# Altium schematic sheet Schem_fcvv01.SchDoc
size 431 x 279 mm; SheetNumber: 1; SheetTotal: 1; ENG_APP_DATE: --/--/--; DSN_APP_DATE: --/--/--; CHK_APP_DATE: --/--/--
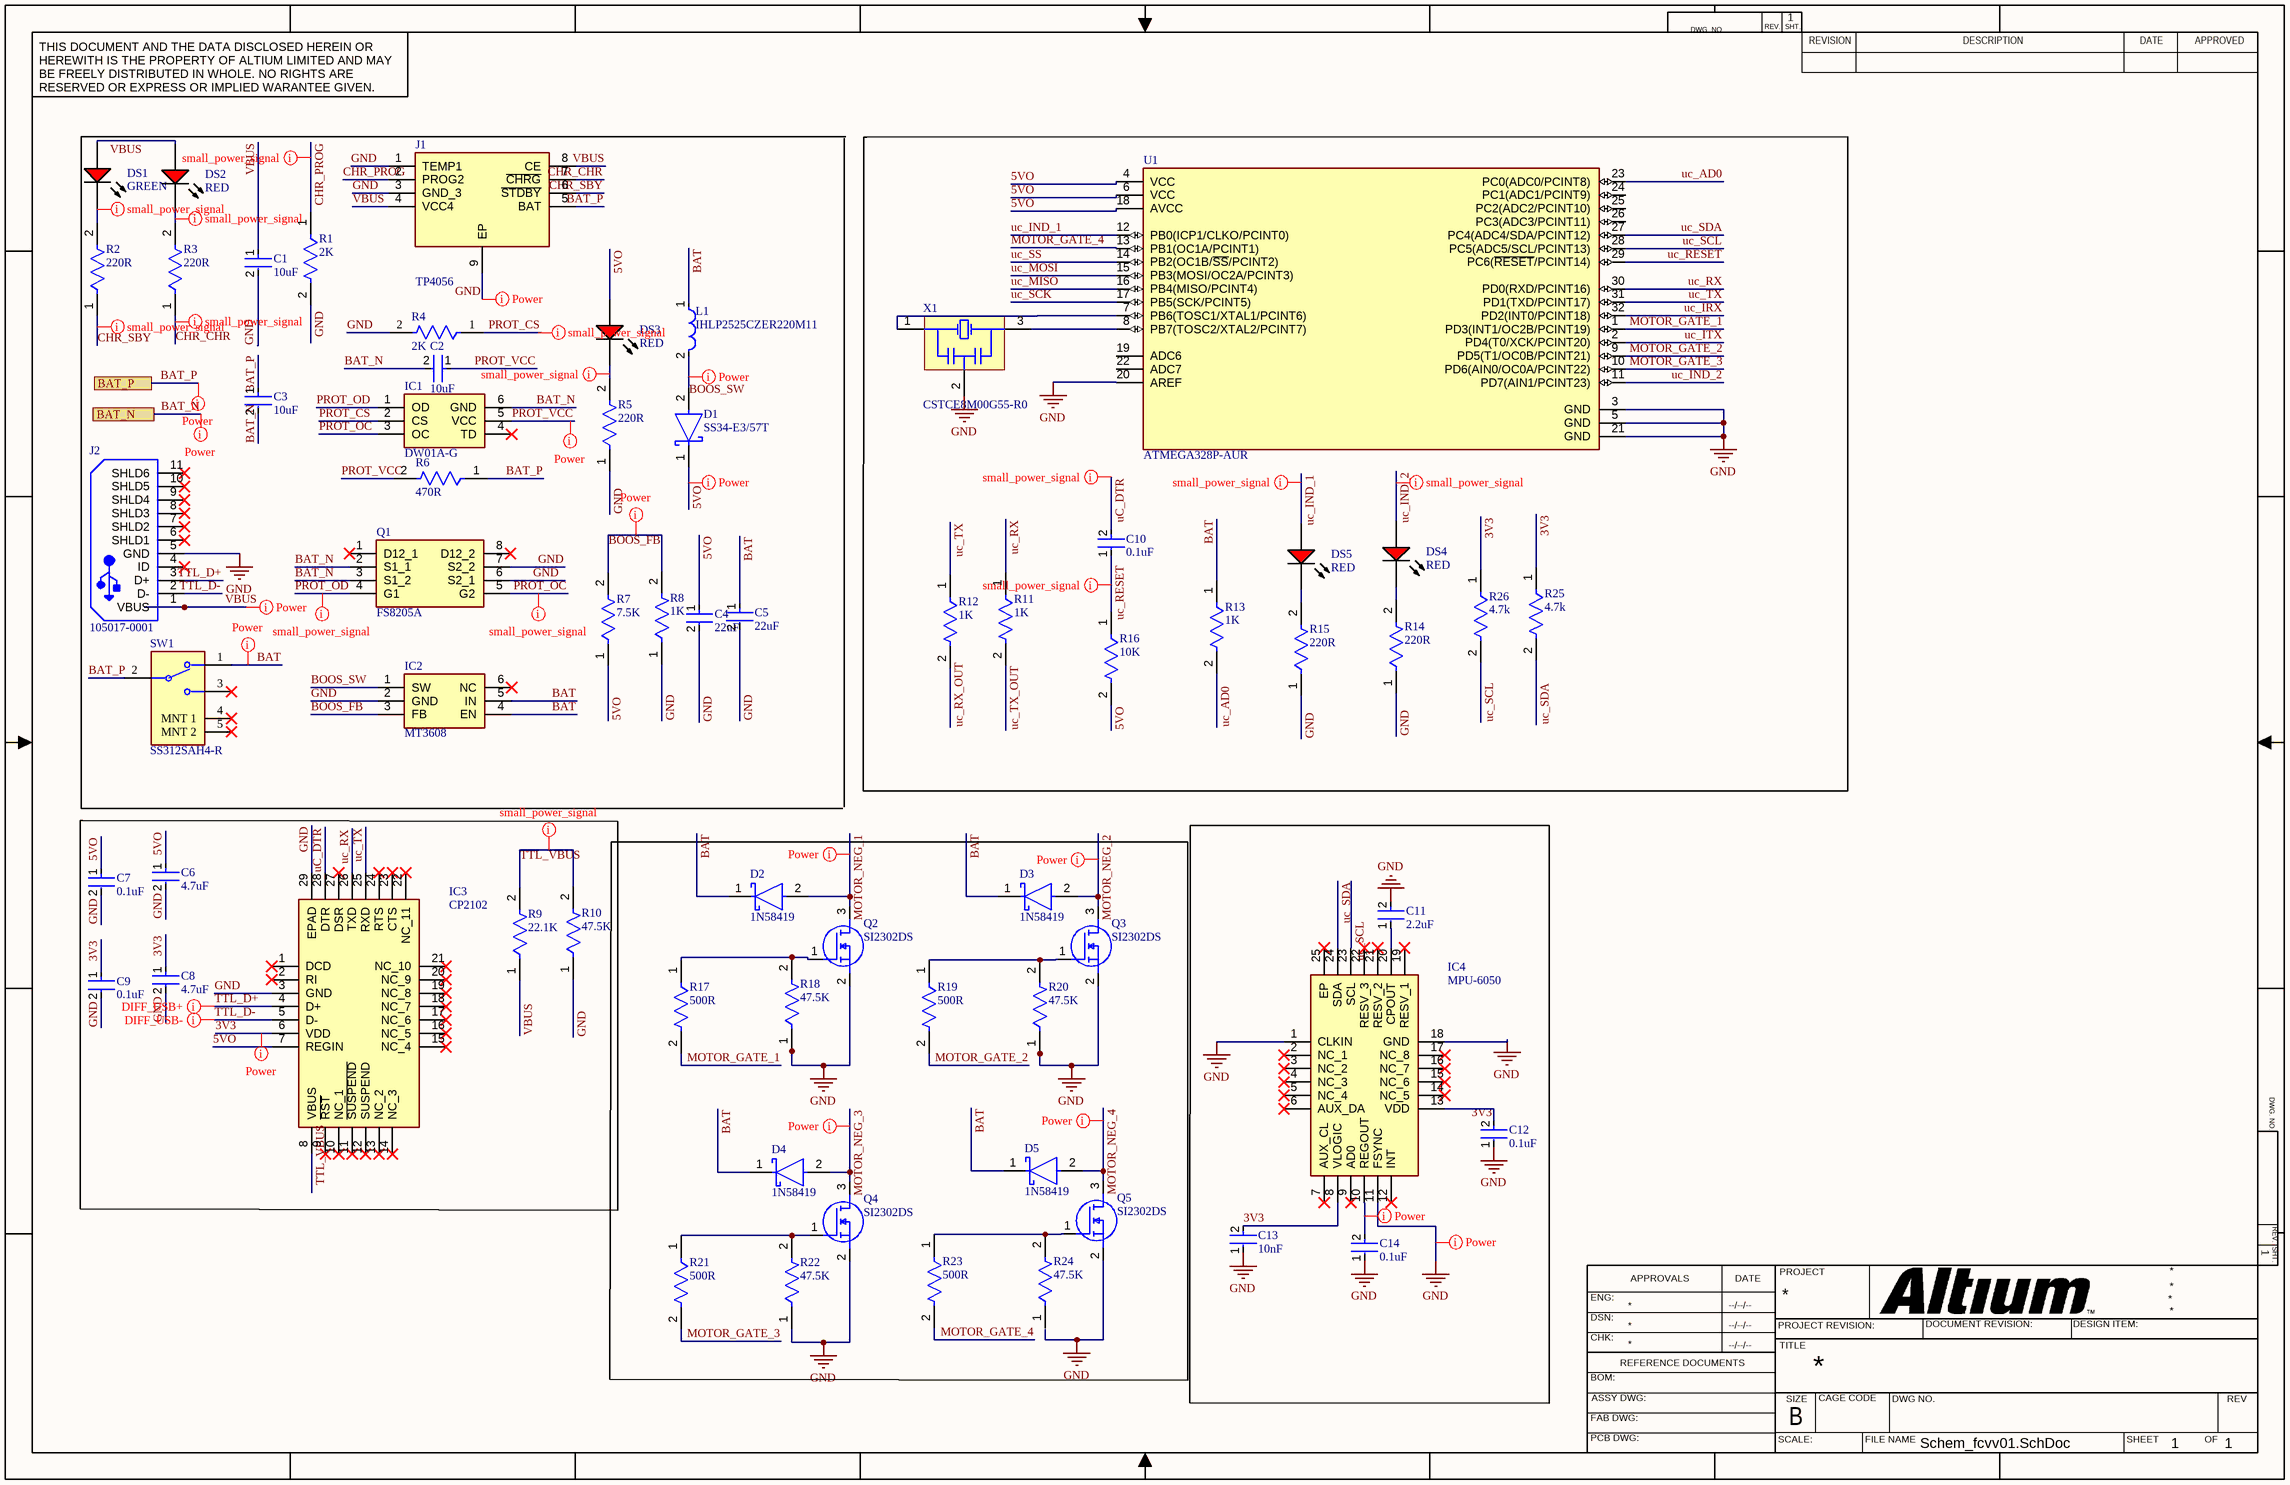
[diagram p0: Schem_fcvv01.SchDoc]

## Parts
C1  10uF  [FP-GRM188-0_1-e0_2_0_55-IPC_A]
C2  10uF  [FP-GRM188-0_1-e0_2_0_55-IPC_A]
C3  10uF  [FP-GRM188-0_1-e0_2_0_55-IPC_A]
C4  22uF  [FP-GRM188-0_1-e0_2_0_55-IPC_A]
C5  22uF  [FP-GRM188-0_1-e0_2_0_55-IPC_A]
C6  4.7uF  [FP-GRM188-0_1-e0_2_0_55-IPC_A]
C7  0.1uF  [FP-GRM188-0_1-e0_2_0_55-IPC_A]
C8  4.7uF  [FP-GRM188-0_1-e0_2_0_55-IPC_A]
C9  0.1uF  [FP-GRM188-0_1-e0_2_0_55-IPC_A]
C10  0.1uF  [FP-GRM15-MFG]
C11  2.2uF  [FP-GRM15-MFG]
C12  0.1uF  [FP-GRM15-MFG]
C13  10nF  [FP-GRM15-MFG]
C14  0.1uF  [FP-GRM15-MFG]
D1  SS34-E3/57T  [FP-95402-MFG]
D2  1N58419  [FP-425-04-IPC_C]
D3  1N58419  [FP-425-04-IPC_C]
D4  1N58419  [FP-425-04-IPC_C]
D5  1N58419  [FP-425-04-IPC_C]
DS1  GREEN  [VISH-TLMX1100_V]
DS2  RED  [VISH-TLMX1100_V]
DS3  RED  [VISH-TLMX1100_V]
DS4  RED  [VISH-TLMX1100_V]
DS5  RED  [VISH-TLMX1100_V]
IC1  DW01A-G  [SOT95P280X135-6N]
IC2  MT3608  [SOT95P280X145-6N]
IC3  CP2102  [QFN50P500X500X100-29N-D]
IC4  MPU-6050  [MPU6050]
J1  TP4056  [SOIC127P600X175-9N]
J2  105017-0001  [USB-MICRO-B_V]
L1  IHLP2525CZER220M11  [FP-IHLP-2525CZ-FP_2_413x3-MFG]
Q1  FS8205A  [SOP65P640X120-8N]
Q2  SI2302DS  [SOT95P230X110-3N]
Q3  SI2302DS  [SOT95P230X110-3N]
Q4  SI2302DS  [SOT95P230X110-3N]
Q5  SI2302DS  [SOT95P230X110-3N]
R1  2K  [FP-CRCW0402-e3-IPC_C]
R2  220R  [FP-CRCW0402-e3-IPC_C]
R3  220R  [FP-CRCW0402-e3-IPC_C]
R4  2K  [FP-ERA3A-IPC_C]
R5  220R  [FP-CRCW0402-e3-IPC_C]
R6  470R  [FP-CRCW0402-e3-IPC_C]
R7  7.5K  [FP-CRCW0402-e3-IPC_C]
R8  1K  [FP-CRCW0402-e3-IPC_C]
R9  22.1K  [FP-CRCW0402-e3-IPC_C]
R10  47.5K  [FP-CRCW0402-e3-IPC_C]
R11  1K  [FP-CRCW0402-e3-IPC_C]
R12  1K  [FP-CRCW0402-e3-IPC_C]
R13  1K  [FP-CRCW0402-e3-IPC_C]
R14  220R  [FP-CRCW0402-e3-IPC_C]
R15  220R  [FP-CRCW0402-e3-IPC_C]
R16  10K  [FP-CRCW0402-e3-IPC_C]
R17  500R  [FP-CRCW0402-e3-IPC_C]
R18  47.5K  [FP-CRCW0402-e3-IPC_C]
R19  500R  [FP-CRCW0402-e3-IPC_C]
R20  47.5K  [FP-CRCW0402-e3-IPC_C]
R21  500R  [FP-CRCW0402-e3-IPC_C]
R22  47.5K  [FP-CRCW0402-e3-IPC_C]
R23  500R  [FP-CRCW0402-e3-IPC_C]
R24  47.5K  [FP-CRCW0402-e3-IPC_C]
R25  4.7k  [FP-CRCW0402-e3-IPC_C]
R26  4.7k  [FP-CRCW0402-e3-IPC_C]
SW1  SS312SAH4-R  [FP-SS312SAH4-R-MFG]
U1  ATMEGA328P-AUR  [FP-32A-IPC_C]
X1  CSTCE8M00G55-R0  [MURA-CSTCE_G_A-3_V]

## Ports
BAT_N, BAT_P

## Nets
GND: C1.2 C4.2 C5.2 C6.2 C7.2 C8.2 C9.2 C11.2 C12.1 C13.1 C14.1 IC2.2(GND) IC3.3(GND) IC3.29(EPAD) IC4.1(CLKIN) IC4.11(FSYNC) IC4.18(GND) J1.1(TEMP1) J1.3(GND_3) J1.9(EP) J2.5(GND) Q1.6(S2_1) Q1.7(S2_2) Q2.2(S) Q3.2(S) Q4.2(S) Q5.2(S) R1.2 R4.2 R5.1 R8.1 R10.1 R14.1 R15.1 R18.1 R20.1 R22.1 U1.3(GND) U1.5(GND) U1.20(AREF) U1.21(GND) X1.2(GND)
3V3: C8.1 C9.1 C12.2 C13.2 IC3.6(VDD) IC4.8(VLOGIC) IC4.13(VDD) R25.1 R26.1
5VO: C4.1 C6.1 C7.1 D1.1(C) DS3.1(A) IC3.7(REGIN) R7.1 R16.2 U1.4(VCC) U1.6(VCC) U1.18(AVCC)
BAT: C5.1 D2.1(C) D3.1(C) D4.1(C) D5.1(C) IC2.4(EN) IC2.5(IN) L1.1 R13.1 SW1.1
BAT_N: C2.2 C3.2 IC1.6(GND) Q1.2(S1_1) Q1.3(S1_2) ; port BAT_N
BAT_P: C3.1 J1.5(BAT) R6.1 SW1.2(COM) ; port BAT_P
BOOS_FB: IC2.3(FB) R7.2 R8.2
BOOS_SW: D1.2(A) IC2.1(SW) L1.2
CHR_CHR: J1.7(~{CHRG}) R3.1
CHR_PROG: J1.2(PROG2) R1.1
CHR_SBY: J1.6(~{STDBY}) R2.1
MOTOR_GATE_1: R17.2 U1.1(PD3(INT1/OC2B/PCINT19))
MOTOR_GATE_2: R19.2 U1.9(PD5(T1/OC0B/PCINT21))
MOTOR_GATE_3: R21.2 U1.10(PD6(AIN0/OC0A/PCINT22))
MOTOR_GATE_4: R23.2 U1.13(PB1(OC1A/PCINT1))
MOTOR_NEG_1: D2.2(A) Q2.3(D)
MOTOR_NEG_2: D3.2(A) Q3.3(D)
MOTOR_NEG_3: D4.2(A) Q4.3(D)
MOTOR_NEG_4: D5.2(A) Q5.3(D)
PROT_CS: IC1.2(CS) R4.1
PROT_OC: IC1.3(OC) Q1.5(G2)
PROT_OD: IC1.1(OD) Q1.4(G1)
PROT_VCC: C2.1 IC1.5(VCC) R6.2
TTL_D+: IC3.4(D+) J2.3(D+)
TTL_D-: IC3.5(D-) J2.2(D-)
TTL_VBUS: IC3.8(VBUS) R9.2 R10.2
uc_AD0: R13.2 U1.23(PC0(ADC0/PCINT8))
uC_DTR: C10.2 IC3.28(DTR)
uc_IND_1: DS5.1(A) U1.12(PB0(ICP1/CLKO/PCINT0))
uc_IND_2: DS4.1(A) U1.11(PD7(AIN1/PCINT23))
uc_IRX: U1.32(PD2(INT0/PCINT18))
uc_ITX: U1.2(PD4(T0/XCK/PCINT20))
uc_MISO: U1.16(PB4(MISO/PCINT4))
uc_MOSI: U1.15(PB3(MOSI/OC2A/PCINT3))
uc_RESET: C10.1 R16.1 U1.29(PC6(~{RESET}/PCINT14))
uc_RX: IC3.26(TXD) R11.1 U1.30(PD0(RXD/PCINT16))
uc_RX_OUT: R12.2
uc_SCK: U1.17(PB5(SCK/PCINT5))
uc_SCL: IC4.23(SCL) R26.2 U1.28(PC5(ADC5/SCL/PCINT13))
uc_SDA: IC4.24(SDA) R25.2 U1.27(PC4(ADC4/SDA/PCINT12))
uc_SS: U1.14(PB2(OC1B/~{SS}/PCINT2))
uc_TX: IC3.25(RXD) R12.1 U1.31(PD1(TXD/PCINT17))
uc_TX_OUT: R11.2
VBUS: C1.1 DS1.1(A) DS2.1(A) J1.4(VCC4) J1.8(CE) J2.1(VBUS) R9.1
NetC11_1: C11.1 IC4.20(CPOUT)
NetC14_2: C14.2 IC4.10(REGOUT)
NetDS1_2: DS1.2(K) R2.2
NetDS2_2: DS2.2(K) R3.2
NetDS3_2: DS3.2(K) R5.2
NetDS4_2: DS4.2(K) R14.2
NetDS5_2: DS5.2(K) R15.2
NetQ2_1: Q2.1(G) R17.1 R18.2
NetQ3_1: Q3.1(G) R19.1 R20.2
NetQ4_1: Q4.1(G) R21.1 R22.2
NetQ5_1: Q5.1(G) R23.1 R24.2
NetU1_7: U1.7(PB6(TOSC1/XTAL1/PCINT6)) X1.1(X1)
NetU1_8: U1.8(PB7(TOSC2/XTAL2/PCINT7)) X1.3(X2)

Not connected (* = marked no-connect by the designer): IC1 4(TD)*; IC2 6(NC)*; IC3 1(DCD)* 2(RI)* 9(~{RST})* 10(NC_1)* 11(~{SUSPEND})* 12(SUSPEND)* 13(NC_2)* 14(NC_3)* 15(NC_4)* 16(NC_5)* 17(NC_6)* 18(NC_7)* 19(NC_8)* 20(NC_9)* 21(NC_10)* 22(NC_11)* 23(CTS)* 24(RTS)* 27(DSR)*; IC4 2(NC_1)* 3(NC_2)* 4(NC_3)* 5(NC_4)* 6(AUX_DA)* 7(AUX_CL)* 9(AD0)* 12(INT)* 14(NC_5)* 15(NC_6)* 16(NC_7)* 17(NC_8)* 19(RESV_1)* 21(RESV_2)* 22(RESV_3)* 25(EP)*; J2 4(ID)* 6(SHLD1)* 7(SHLD2)* 8(SHLD3)* 9(SHLD4)* 10(SHLD5)* 11(SHLD6)*; Q1 1(D12_1)* 8(D12_2)*; R24 1; SW1 3* 4(MNT_1)* 5(MNT_2)*; U1 19(ADC6) 22(ADC7) 24(PC1(ADC1/PCINT9)) 25(PC2(ADC2/PCINT10)) 26(PC3(ADC3/PCINT11))

## Layout directives
net class Power: 3V3, BAT_N, BAT_P, GND, MOTOR_NEG_1, MOTOR_NEG_2, MOTOR_NEG_3, MOTOR_NEG_4, NetC14_2
mark named Power: 5VO, BAT, BOOS_FB, BOOS_SW, GND, PROT_VCC, VBUS
differential pair; differential pair class USB: TTL_D+, TTL_D-
net class small_power_signal: CHR_CHR, CHR_PROG, CHR_SBY, NetDS1_2, NetDS2_2, NetDS3_2, PROT_CS, PROT_OC, PROT_OD, uC_DTR, uc_IND_1, uc_IND_2, uc_RESET
mark named small_power_signal: TTL_VBUS

## Notes on the sheet
- DWG. NO.
- REV.
- SHT.
- THIS DOCUMENT AND THE DATA DISCLOSED HEREIN OR HEREWITH IS THE PROPERTY OF ALTIUM LIMITED AND MAY BE FREELY DISTRIBUTED IN WHOLE. NO RIGHTS ARE RESERVED OR EXPRESS OR IMPLIED WARANTEE GIVEN.
- REVISION
- DESCRIPTION
- DATE
- APPROVED
- ENG:
- APPROVALS
- PROJECT
- DSN:
- CHK:
- REFERENCE DOCUMENTS
- PROJECT REVISION:
- TITLE
- DOCUMENT REVISION:
- DESIGN ITEM:
- BOM:
- FAB DWG:
- PCB DWG:
- ASSY DWG:
- SCALE:
- SIZE
- B
- CAGE CODE
- FILE NAME
- DWG NO.
- SHEET
- OF
- REV

## Library data of the parts
C1 C2 C4 C5 = CMP-2006-02792-2: 10uF 0603; Voltage Rating (DC): 6.3V; Dielectric: X5R; Material: Ceramic; Tolerance: 20%; Packaging: Tape and Reel; Width: 0.031inch; Termination: SMD/SMT; Package Quantity: 4000; Voltage Rating: 6.3V; Capacitance: 10uF; Case/Package: 0603; Min Operating Temperature: -55°C; Voltage: 6.3V; Length: 1.6mm; Thickness: 0.035inch; Lead Free: Lead Free; Depth: 0.8mm; Case Code (Imperial): 0603; Max Operating Temperature: 85°C; Height: 0.8mm; Mount: Surface Mount; REACH SVHC: No SVHC; Radiation Hardening: No; Case Code (Metric): 1608
C3 = CMP-2006-02792-2: 0603; Voltage Rating (DC): 6.3V; Dielectric: X5R; Material: Ceramic; Tolerance: 20%; Packaging: Tape and Reel; Width: 0.031inch; Termination: SMD/SMT; Package Quantity: 4000; Voltage Rating: 6.3V; Capacitance: 10uF; Case/Package: 0603; Min Operating Temperature: -55°C; Voltage: 6.3V; Length: 1.6mm; Thickness: 0.035inch; Lead Free: Lead Free; Depth: 0.8mm; Case Code (Imperial): 0603; Max Operating Temperature: 85°C; Height: 0.8mm; Mount: Surface Mount; REACH SVHC: No SVHC; Radiation Hardening: No; Case Code (Metric): 1608
C6-C9 = CMP-2006-02792-2: 0603; Voltage Rating (DC): 6.3V; Dielectric: X5R; Capacitance: 10uF; Material: Ceramic; Tolerance: 20%; Packaging: Tape and Reel; Width: 0.031inch; Termination: SMD/SMT; Package Quantity: 4000; Voltage Rating: 6.3V; Case/Package: 0603; Min Operating Temperature: -55°C; Voltage: 6.3V; Length: 1.6mm; Thickness: 0.035inch; Lead Free: Lead Free; Depth: 0.8mm; Case Code (Imperial): 0603; Max Operating Temperature: 85°C; Height: 0.8mm; Mount: Surface Mount; REACH SVHC: No SVHC; Radiation Hardening: No; Case Code (Metric): 1608
C10-C14 = CMP-2100-03641-2: CAP CER 0.1UF 16V X7R 0402; Manufacturer Part Number: GRM155R71C104KA88D; Manufacturer: Murata; Standoff Height: 0mm; Tolerance: 10%; Voltage Rating: 16Vdc; Material: Ceramic; Capacitance: 0.10μF; Value: 0.10μF; RoHS: TRUE; Temperature Characteristic: X7R; Octopart: https://octopart.com/grm155r71c104ka88d-murata-196880; Digikey Description: CAP CER 0.1UF 16V X7R 0402; Device Class L3: Ceramic Capacitors; Height: 0.55mm; ComponentLink2Description: Datasheet; Temperature Range Low: -55°C; Ipc Land Pattern Name: CAPC10050X219; ComponentLink2URL: https://search.murata.co.jp/Ceramy/image/img/A01X/G101/ENG/GRM155R71H471KA01-01A.pdf; Device Class L1: Passive Components; Lead Free: yes; Category: Cap; Package: GRM15; Temperature: -55°C to +125°C; Device Class L2: Capacitors; Temperature Range High: +125°C; Mouser Description: 0402 0.1 uF 16V ±10 % Tolerance X7R SMT Multilayer Ceramic Capacitor
D1 = CMP-02539-000012-1: DIODE SCHOTTKY 40V 3A DO214AB; Manufacturer: Vishay; Max Junction Temp: +150°C; Peak Reverse Current: 0.5mA; Max Surge Forward Current: 100A; Standoff Height: 0mm; ComponentLink2Description: Datasheet; Device Class L3: Schottky Diodes; Height: 2.62mm; Max Repetitive Reverse Voltage: 40V; Lead Free: Yes; Package: 95402; Temperature Range High: +150°C; ComponentLink2URL: http://www.vishay.com/docs/88751/ss32.pdf; Temperature: -55°C to +150°C; Footprint Url: http://www.vishay.com/docs/95402/smc.pdf; Automotive: No; Forward Current: 3A; Category: Diode; Manufacturer Part Number: SS34-E3/57T; RoHS: TRUE; Device Class L2: Diodes; Mouser Description: Schottky Diodes & Rectifiers 3.0 Amp 40 Volt; Octopart: https://octopart.com/ss34-e3%2F57t-vishay-39552907; Temperature Range Low: -55°C; Device Class L1: Discrete Semiconductors; Digikey Description: DIODE SCHOTTKY 40V 3A DO214AB
D2-D5 = CMP-1055-00425-2: DIODE SCHOTTKY 20V 500MA SOD123; Polarity: Standard; Peak Non-Repetitive Surge Current: 5.5A; Forward Voltage: 385mV; Element Configuration: Single; Peak Reverse Current: 250uA; Max Repetitive Reverse Voltage (Vrrm): 20V; Voltage Rating (DC): 20V; Case/Package: SOD-123-2; Number of Pins: 2; Output Current: 500mA; Min Operating Temperature: -65°C; Lead Free: Lead Free; REACH SVHC: No SVHC; Max Reverse Voltage (DC): 20V; Termination: SMD/SMT; Average Rectified Current: 500mA; Max Surge Current: 5.5A; Package Quantity: 3000; Height: 1.12mm; Current Rating: 500mA; Forward Current: 500mA; Max Forward Surge Current (Ifsm): 5.5A; Packaging: Tape and Reel; Length: 2.69mm; Radiation Hardening: No; Max Reverse Leakage Current: 250uA; Width: 1.6mm; Contact Plating: Tin; Max Operating Temperature: 125°C
DS1-DS5 = CMP-1666-00027-1: Red 0603 Light Emitting Diodes (LED) ROHS/NCD0603R1; Type (Capacitors): C0G; Resistance: 100000000000 Ohm; Capacitance: 12 pF; Voltage Rating: 50 V; Tolerance: 5%; Min Operating Temperature: -55degC; REACH SVHC: No SVHC; ComponentLink2Description: Datasheet; ComponentLink1URL: http://www.vishay.com/; Width: 0.8 mm; Package Quantity: 4000; PackageReference: TLMX1100; ComponentLink2URL: http://www.vishay.com/docs/83173/tlmb1100.pdf; Case/Package: 0603; Case Code (Metric): 1608; Packaging: Tape and Reel; Pins: 2; ComponentLink1Description: Manufacturer URL; Max Operating Temperature: 125degC; Height: 0.8 mm; Length: 1.6 mm; Mount: Surface Mount; PackageDescription: 2-Pin Surface Mount Device, Body 1.6 x 0.8 mm; DatasheetVersion: Rev. 2.7, 03/2016; Case Code (Imperial): 0603; Voltage Rating (DC): 50 V; RoHSCompliant: True; Radiation Hardening: No
IC1 = DW01A-G: Integrated Circuit; Manufacturer_Name: Fortune Semiconductor Corporation; Datasheet Link: http://acoptex.com/uploads/DW01A.pdf; Height: 1.35mm; Manufacturer_Part_Number: DW01A-G
IC2 = MT3608: Integrated Circuit; Manufacturer_Name: Aerosemi; Datasheet Link: https://www.olimex.com/Products/Breadboarding/BB-PWR-3608/resources/MT3608.pdf; Height: 1.45mm; Manufacturer_Part_Number: MT3608
IC3 = CP2102: Integrated Circuit; Manufacturer_Name: Silicon Labs; Datasheet Link: https://componentsearchengine.com/Datasheets/1/CP2102.pdf; Height: 1mm; Manufacturer_Part_Number: CP2102; Mouser Part Number: 634-CP2102; Mouser Price/Stock: https://www.mouser.co.uk/ProductDetail/Silicon-Labs/CP2102?qs=ucY0lxHzU7615lOm95XT0w%3D%3D
IC4 = MPU-6050: Integrated Circuit; Manufacturer_Name: TDK; Datasheet Link: https://product.tdk.com/system/files/dam/doc/product/sensor/mortion-inertial/imu/data_sheet/mpu-6000-datasheet1.pdf; Height: 0.95mm; Manufacturer_Part_Number: MPU-6050; Mouser Part Number: 410-MPU-6050; Mouser Price/Stock: https://www.mouser.co.uk/ProductDetail/TDK-InvenSense/MPU-6050?qs=u4fy%2FsgLU9O14B5JgyQFvg%3D%3D; Arrow Part Number: MPU-6050; Arrow Price/Stock: https://www.arrow.com/en/products/mpu-6050/invensense?region=nac
J1 = TP4056: Connector; Manufacturer_Name: NanJing Top Power; Datasheet Link: https://dlnmh9ip6v2uc.cloudfront.net/datasheets/Prototyping/TP4056.pdf; Height: 1.75mm; Manufacturer_Part_Number: TP4056
J2 = CMP-2000-05827-1: Micro-USB B Receptacle, Right Angle, Bottom Mount, Surface Mount, with Solder Tabs, -30 to 85 degC, 5-Pin USB, RoHS, Tape and Reel; Manufacturer: Molex; Featured Product: Micro-USBConnectorsUSBConnectors; Other Names: WM1399DKR; Package Version: Rev. F, 12/2012; Number of Contacts: 5; Connector Type: USB-microB; Catalog Drawings: 1050170001; 3D Model: 105017-0001.stp; Mating Products: WM17145-ND-CABLEMICROUSBBTOSTDA1.0MWM17147-ND-CABLEMICROUSBBTOSTDA2.0MWM17146-ND-CABLEMICROUSBBTOSTDA1.5M; PCN Assembly/Origin: ResinSupplier21/Oct/2015; Voltage - Max: 30V; Online Catalog: Molex-MicroUSB; Manufacturer URL: http://www.molex.com/; Package Description: 5-Leads USB, Micro B, Body 7.5 x 5 mm, Pitch 0.65 mm; Datasheet URL: http://www.molex.com/elqNow/elqRedir.htm?ref=http://www.molex.com/webdocs/datasheets/pdf/en-us/1050170001_IO_CONNECTORS.pdf; Ingress Protection: -; Datasheet Version: 03/2016; Mounting Type: BoardCutout,SurfaceMount,RightAngle; Circuits: 5; Standard Package: 1; Package Reference: MICRO-B; Package URL: http://www.molex.com/pdm_docs/sd/1050170001_sd.pdf; Category: Connectors,Interconnects; Series: -; RoHS Information: 1050170001CertofCompliance; Features: Shielded,SolderRetention; Family: USB,DVI,HDMIConnectors; Specifications: -; Gender: Receptacle; Packaging: Digi-Reel®; Mounting Technology: SurfaceMount
L1 = CMP-2000-06442-2: Commercial Inductors, Low DCR Series 22uH 2.9A 135mΩ 20%; Self Resonant Frequency: 1MHz; Shielding: Shielded; Core Material: Ferrite; DC Resistance (DCR): 135mR; Test Frequency: 100kHz; Saturation Current: 2.5A; Case/Package: 2525; Inductance Tolerance: 20%; Max DC Current: 2.9A; Inductance: 22uH; Termination: SMD/SMT; Case Code (Imperial): 2525; Mount: Surface Mount; Military Standard: Not; Min Operating Temperature: -55°C; RMS Current (Irms): 2.9A; Package Quantity: 2000; Max Operating Temperature: 125°C; Length: 7.24mm; Depth: 6.72mm; Packaging: Tape and Reel; Height: 3mm; Width: 0.255inch; Lead Free: Lead Free; Tolerance: 20%; Contact Plating: Tin; Current Rating: 2.9A; Number of Pins: 2; Case Code (Metric): 6363; Radiation Hardening: No; Height - Seated (Max): 0.118inch
Q1 = FS8205A: Transistor; Manufacturer_Name: SII Semiconductor; Datasheet Link: http://www.ic-fortune.com/upload/Download/FS8205A-DS-12_EN.pdf; Height: 1.2mm; Manufacturer_Part_Number: FS8205A
Q2-Q5 = SI2302DS: MOSFET (N-Channel); Manufacturer_Name: Nexperia; Datasheet Link: https://assets.nexperia.com/documents/data-sheet/SI2302DS.pdf; Height: 1.1mm; Manufacturer_Part_Number: SI2302DS; Mouser Part Number: N/A; Mouser Price/Stock: https://www.mouser.com/Search/Refine.aspx?Keyword=N%2FA
R1 = CMP-2002-08122-2: 62.5mW Thick Film Resistors 50V ±100ppm/℃ ±5% -55℃~+155℃ 2kΩ 0402 Chip Resistor - Surface Mount ROHS/CR-02JL6----2K; Max Power Dissipation: 63mW; Temperature Coefficient: 100ppm/°C; Resistance: 0mR; Tolerance: 5%; Contact Plating: Tin; Height: 0.35mm; Radiation Hardening: No; Features: Automotive AEC-Q200; Composition: Thick Film; Width: 0.5mm; Weight: 2.3E-05oz; Termination: SMD/SMT; Packaging: Tape and Reel; Mount: Surface Mount; Case Code (Metric): 1005; Military Standard: Not; Min Operating Temperature: -55°C; Number of Terminations: 2; Package Quantity: 1; Voltage Rating: 50V; Case Code (Imperial): 0402; Depth: 0.5mm; Max Operating Temperature: 155°C; Case/Package: 0402; Power Rating: 63mW; Lead Free: Lead Free; Voltage Rating (DC): 50V; Length: 1mm
R2 R3 R5 R14 R15 = CMP-2002-08122-2: 62.5mW Thick Film Resistors 50V ±100ppm/℃ ±1% -55℃~+155℃ 220Ω 0402 Chip Resistor - Surface Mount ROHS/RC0402FR-07220RL; Tolerance: 5%; Max Power Dissipation: 63mW; Temperature Coefficient: 100ppm/°C; Resistance: 0mR; Contact Plating: Tin; Height: 0.35mm; Radiation Hardening: No; Features: Automotive AEC-Q200; Composition: Thick Film; Width: 0.5mm; Weight: 2.3E-05oz; Termination: SMD/SMT; Packaging: Tape and Reel; Mount: Surface Mount; Case Code (Metric): 1005; Military Standard: Not; Min Operating Temperature: -55°C; Number of Terminations: 2; Package Quantity: 1; Voltage Rating: 50V; Case Code (Imperial): 0402; Depth: 0.5mm; Max Operating Temperature: 155°C; Case/Package: 0402; Power Rating: 63mW; Lead Free: Lead Free; Voltage Rating (DC): 50V; Length: 1mm
R4 = CMP-2000-00874-2: 100mW Thick Film Resistors 75V ±1% -55℃~+155℃ 2kΩ 0603 Chip Resistor - Surface Mount ROHS/CR-03FA7----2K; Resistance: 10kR; Temperature Coefficient: 25ppm/°C; Resistance Tolerance: 0.1%; Radiation Hardening: No; Width: 0.8mm; Depth: 0.8mm; Construction: Rectangular; Case Code (Metric): 1608; Package Quantity: 5000; Voltage Rating (DC): 75V; Length: 1.6mm; Size Code: 0603; Case Code (Imperial): 0603; Termination: SMD/SMT; Power Rating: 100mW; Contact Plating: Tin; Military Standard: Not; Packaging: Tape and Reel; Max Power Dissipation: 100mW; REACH SVHC: No SVHC; Series: ERA-3A; Voltage Rating: 75V; Lead Free: Lead Free; Technology: METAL FILM; RoHS Compliant: Yes; Max Operating Temperature: 155°C; Resistor Type: Thin Film; Min Operating Temperature: -55°C; Number of Pins: 2; Case/Package: 0603; Tolerance: 0.1%; Height: 0.45mm; Mount: Surface Mount; Number of Terminations: 2
R6 = CMP-2002-08122-2: 62.5mW Thick Film Resistors 50V ±100ppm/℃ ±1% -55℃~+155℃ 470Ω 0402 Chip Resistor - Surface Mount ROHS/AC0402FR-07470RL; Tolerance: 5%; Max Power Dissipation: 63mW; Temperature Coefficient: 100ppm/°C; Resistance: 0mR; Contact Plating: Tin; Height: 0.35mm; Radiation Hardening: No; Features: Automotive AEC-Q200; Composition: Thick Film; Width: 0.5mm; Weight: 2.3E-05oz; Termination: SMD/SMT; Packaging: Tape and Reel; Mount: Surface Mount; Case Code (Metric): 1005; Military Standard: Not; Min Operating Temperature: -55°C; Number of Terminations: 2; Package Quantity: 1; Voltage Rating: 50V; Case Code (Imperial): 0402; Depth: 0.5mm; Max Operating Temperature: 155°C; Case/Package: 0402; Power Rating: 63mW; Lead Free: Lead Free; Voltage Rating (DC): 50V; Length: 1mm
R7 = CMP-2002-08122-2: 63mW Thick Film Resistors 50V ±100ppm/℃ ±1% -55℃~+125℃ 7.5kΩ 0402 Chip Resistor - Surface Mount ROHS/AECR0402F7K50K9; Tolerance: 5%; Temperature Coefficient: 100ppm/°C; Resistance: 0mR; Contact Plating: Tin; Height: 0.35mm; Radiation Hardening: No; Max Power Dissipation: 63mW; Features: Automotive AEC-Q200; Composition: Thick Film; Width: 0.5mm; Weight: 2.3E-05oz; Termination: SMD/SMT; Packaging: Tape and Reel; Mount: Surface Mount; Case Code (Metric): 1005; Military Standard: Not; Min Operating Temperature: -55°C; Number of Terminations: 2; Package Quantity: 1; Voltage Rating: 50V; Case Code (Imperial): 0402; Depth: 0.5mm; Max Operating Temperature: 155°C; Case/Package: 0402; Power Rating: 63mW; Lead Free: Lead Free; Voltage Rating (DC): 50V; Length: 1mm
R8 R11-R13 R16 R25 R26 = CMP-2002-08122-2: 62.5mW Thick Film Resistors 50V ±100ppm/℃ ±1% -55℃~+155℃ 1kΩ 0402 Chip Resistor - Surface Mount ROHS/RC0402FR-071KL; Tolerance: 5%; Max Power Dissipation: 63mW; Temperature Coefficient: 100ppm/°C; Resistance: 0mR; Contact Plating: Tin; Height: 0.35mm; Radiation Hardening: No; Features: Automotive AEC-Q200; Composition: Thick Film; Width: 0.5mm; Weight: 2.3E-05oz; Termination: SMD/SMT; Packaging: Tape and Reel; Mount: Surface Mount; Case Code (Metric): 1005; Military Standard: Not; Min Operating Temperature: -55°C; Number of Terminations: 2; Package Quantity: 1; Voltage Rating: 50V; Case Code (Imperial): 0402; Depth: 0.5mm; Max Operating Temperature: 155°C; Case/Package: 0402; Power Rating: 63mW; Lead Free: Lead Free; Voltage Rating (DC): 50V; Length: 1mm
R9 R17 R19 R21 R23 = CMP-2002-08122-2: 62.5mW Thick Film Resistors 50V ±100ppm/℃ ±1% -55℃~+155℃ 22.1kΩ 0402 Chip Resistor - Surface Mount ROHS/RC0402FR-0722K1L; Tolerance: 5%; Max Power Dissipation: 63mW; Temperature Coefficient: 100ppm/°C; Resistance: 0mR; Contact Plating: Tin; Height: 0.35mm; Radiation Hardening: No; Features: Automotive AEC-Q200; Composition: Thick Film; Width: 0.5mm; Weight: 2.3E-05oz; Termination: SMD/SMT; Packaging: Tape and Reel; Mount: Surface Mount; Case Code (Metric): 1005; Military Standard: Not; Min Operating Temperature: -55°C; Number of Terminations: 2; Package Quantity: 1; Voltage Rating: 50V; Case Code (Imperial): 0402; Depth: 0.5mm; Max Operating Temperature: 155°C; Case/Package: 0402; Power Rating: 63mW; Lead Free: Lead Free; Voltage Rating (DC): 50V; Length: 1mm
R10 R18 R20 R22 R24 = CMP-2002-08122-2: 62.5mW Thin Film Resistor 25V ±0.5% ±50ppm/℃ -55℃~+155℃ 47.5kΩ 0402 Chip Resistor - Surface Mount ROHS/AR02DTD4752; Tolerance: 5%; Max Power Dissipation: 63mW; Voltage Rating: 50V; Temperature Coefficient: 100ppm/°C; Resistance: 0mR; Contact Plating: Tin; Height: 0.35mm; Radiation Hardening: No; Features: Automotive AEC-Q200; Composition: Thick Film; Width: 0.5mm; Weight: 2.3E-05oz; Termination: SMD/SMT; Packaging: Tape and Reel; Mount: Surface Mount; Case Code (Metric): 1005; Military Standard: Not; Min Operating Temperature: -55°C; Number of Terminations: 2; Package Quantity: 1; Case Code (Imperial): 0402; Depth: 0.5mm; Max Operating Temperature: 155°C; Case/Package: 0402; Power Rating: 63mW; Lead Free: Lead Free; Voltage Rating (DC): 50V; Length: 1mm
SW1 = CMP-31746-000001-1: SWITCH SLIDE SPDT 0.4VA 28V; Mechanical Life: 10000Cycles; Switch Function: On-On; Actuator Length: 2mm; Contact Style: Shorting; Max Current Rating: 100mA; Actuator Type: Standard; Actuator Material: Polyphenylene; Length: 10.5mm; Orientation: Right Angle; Voltage Rating (DC): 28V; Contact Material: Bronze; Electrical Life: 10000Cycles; Max Operating Temperature: 85°C; Case/Package: SMD/SMT; Depth: 7.45mm; Contact Plating: Gold; Voltage Rating (AC): 28V; Package Quantity: 1; Min Operating Temperature: -25°C; Switch Travel: 2mm; Housing Material: Bronze; RoHS Compliant: Yes; Lead Free: Lead Free; Termination: Gull Wing; Packaging: Tape and Reel; REACH SVHC: No SVHC; Mount: Surface Mount; Series: SS3; Throw Configuration: SPDT; Max Voltage Rating (AC): 28V; Max Voltage Rating (DC): 28V
U1 = CMP-06276-000046-1: IC MCU 8BIT 32KB FLASH 32TQFP; Number of I/Os: 32; Oscillator Type: Internal; Peripherals: Brown-out Detect/Reset; Core Architecture: PIC; Interface: I2C; Frequency: 40MHz; Case/Package: TQFP; Max Operating Temperature: 85°C; Min Operating Temperature: -40°C; Memory Size: 32KB; Packaging: Cut Tape; Memory Type: FLASH
X1 = CMP-2100-03620-1: Ceramic Resonator, 8 MHz, +/- 0.5%, -20 to 80 degC, 3-Pin SMD, RoHS, Tape and Reel; Manufacturer: Murata; Capacitance: 33pF; Frequency Stability: 0.2%; Self Resonant Frequency: 8MHz; Datasheet Version: 42339.0; RoHSCompliant: True; Datasheet URL: http://www.murata.com/~/media/webrenewal/support/library/catalog/products/timingdevice/ceralock/p16e.ashx; Case/Package: Ceramic; Load Capacitance: 33pF; Tolerance: 0.5%; Mount: SurfaceMount; Height: 0.031inch; Number of Pins: 3; Package Description: 3-Pin Surface Mount Device, Body 3.2 x 1.3 mm, Pitch 1.2 mm; Package Quantity: 1; Lead Free: LeadFree; Contact Plating: Gold; REACH SVHC: NoSVHC; Length: 0.126inch; Width: 0.051inch; Manufacturer URL: http://www.murata.com/; Packaging: TapeandReel; Termination: SMD/SMT; Frequency Tolerance: 0.5%; Max Operating Temperature: 80degC; Composition: Ceramic; Package Reference: CSTCE_G_A-3; Min Operating Temperature: -20degC; Frequency: 8MHz